# Altium schematic sheet GPIO,CONNECTOR.SchDoc: F2837x controlCARD
size 431 x 279 mm; Organization: Texas Instruments; Revision: 1.3
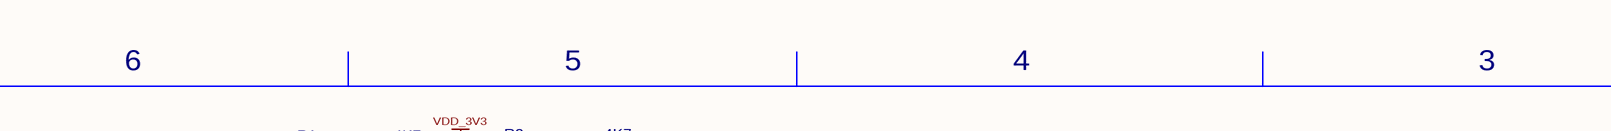
[diagram p0: GPIO,CONNECTOR.SchDoc, top left]
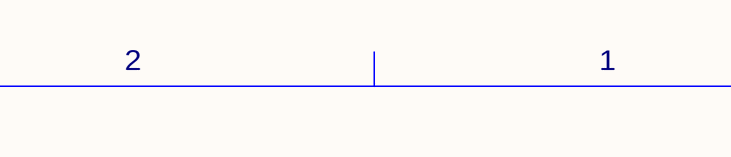
[diagram p1: GPIO,CONNECTOR.SchDoc, top right]
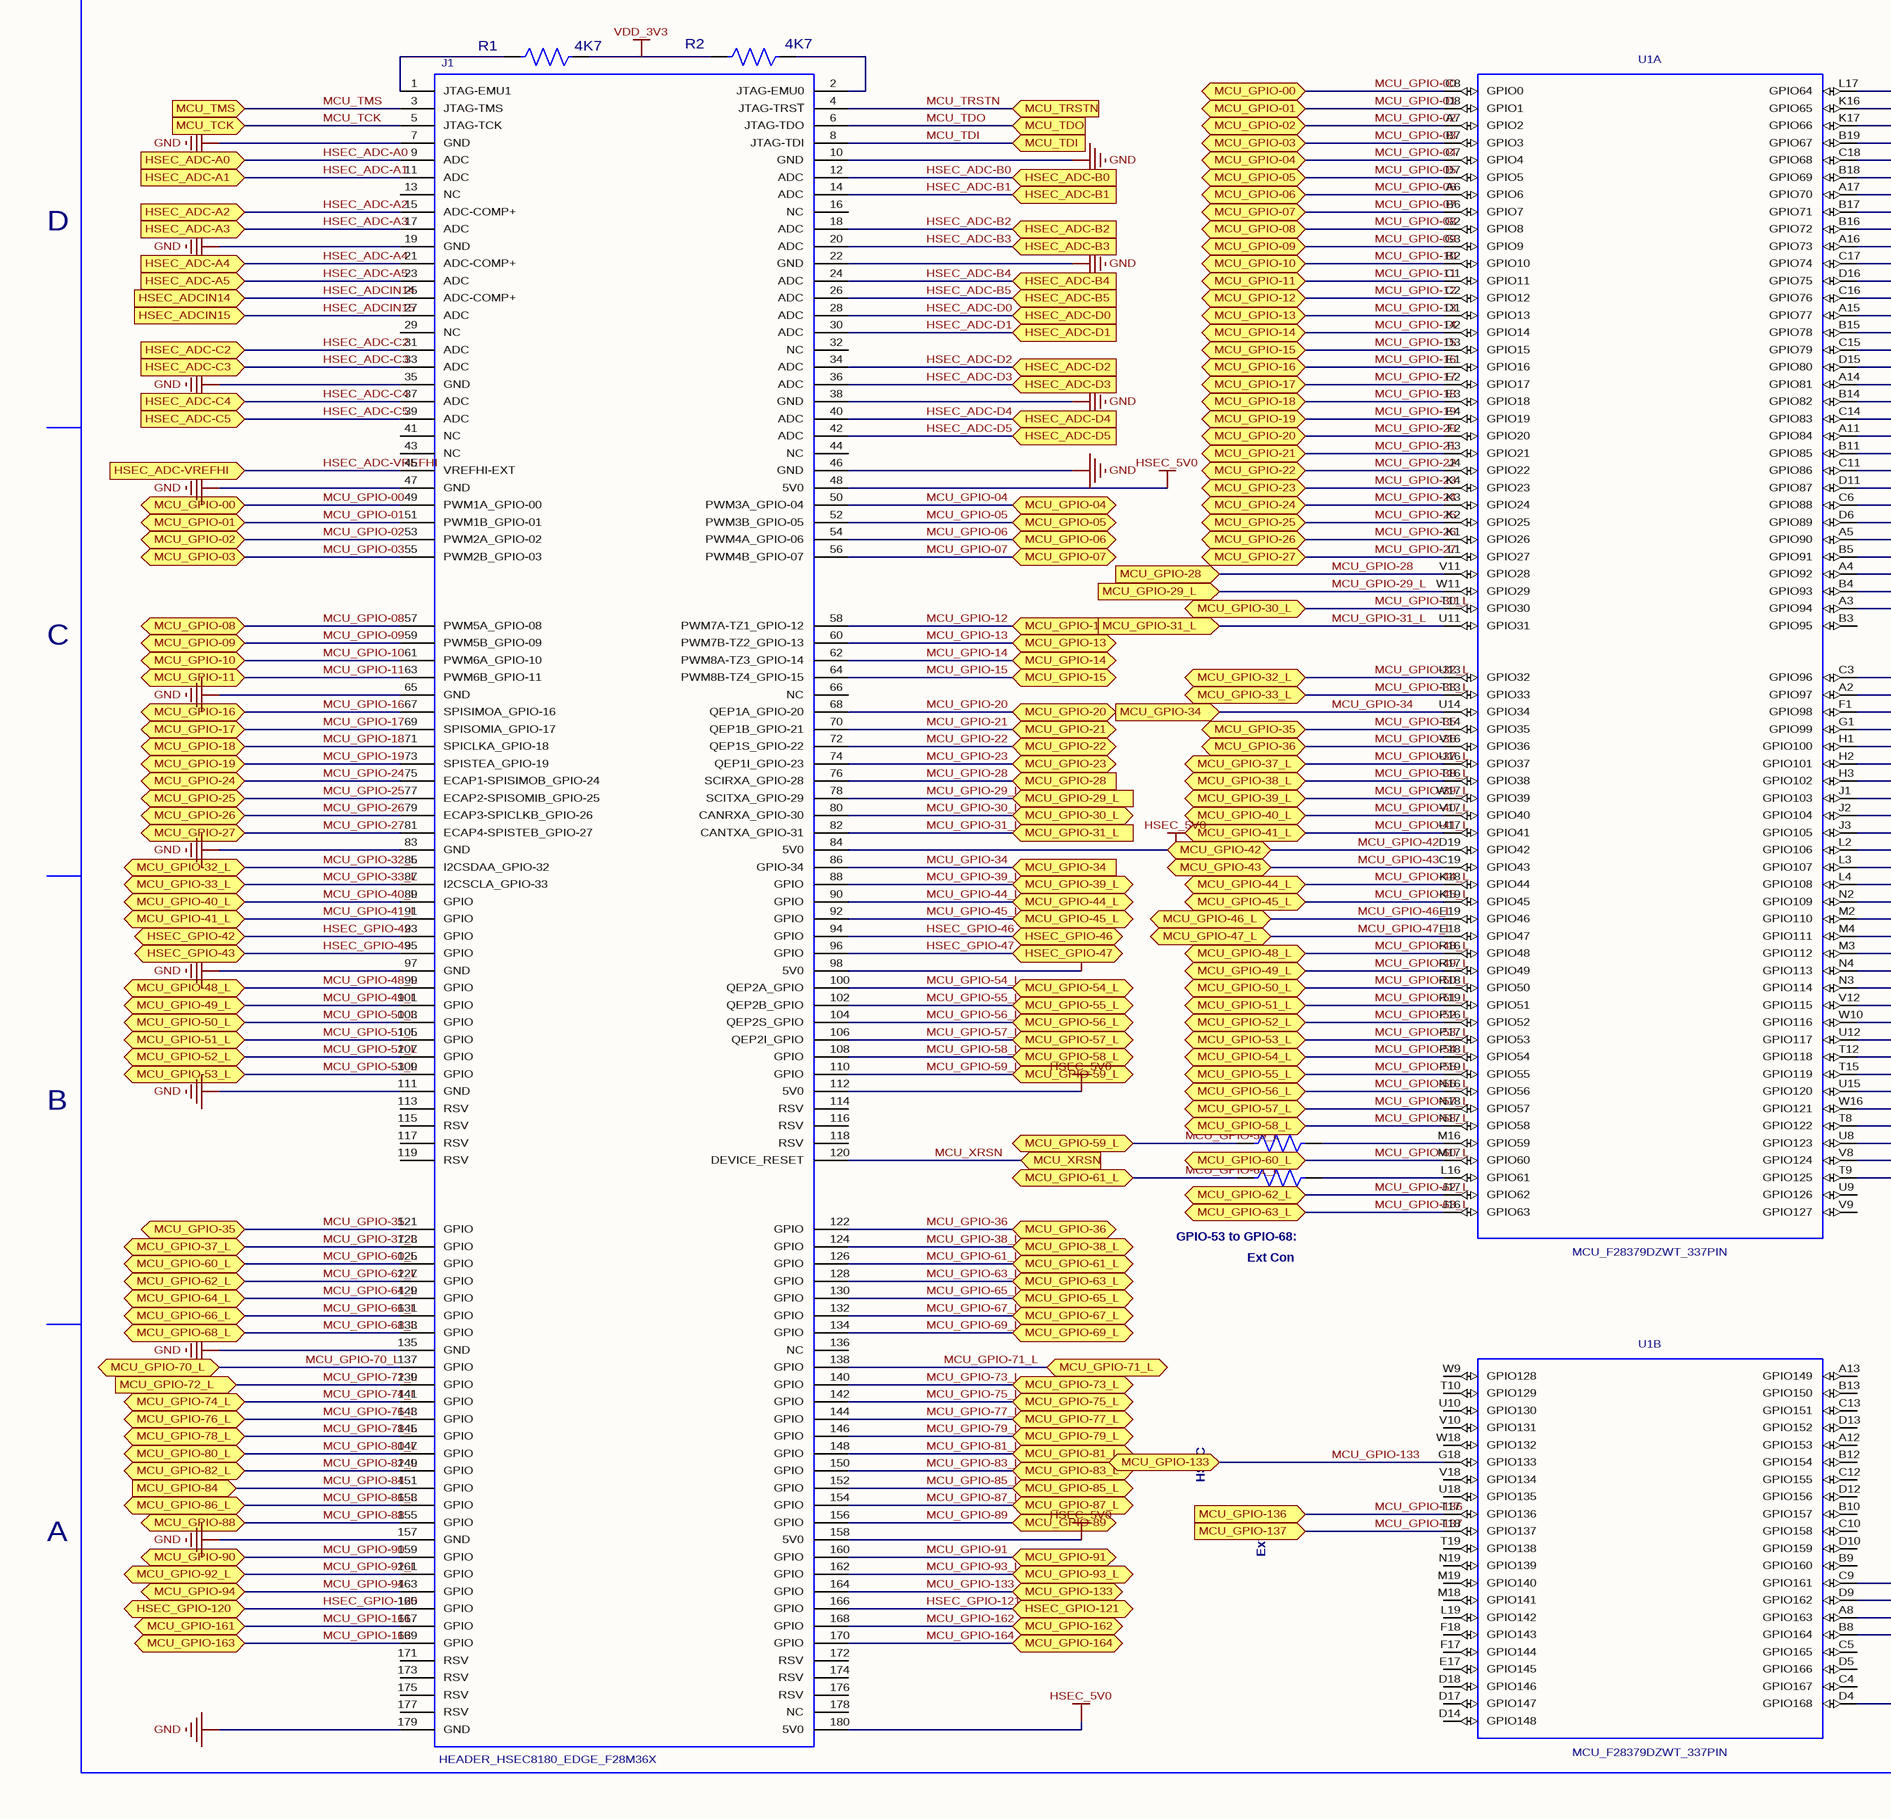
[diagram p2: GPIO,CONNECTOR.SchDoc, bottom left]
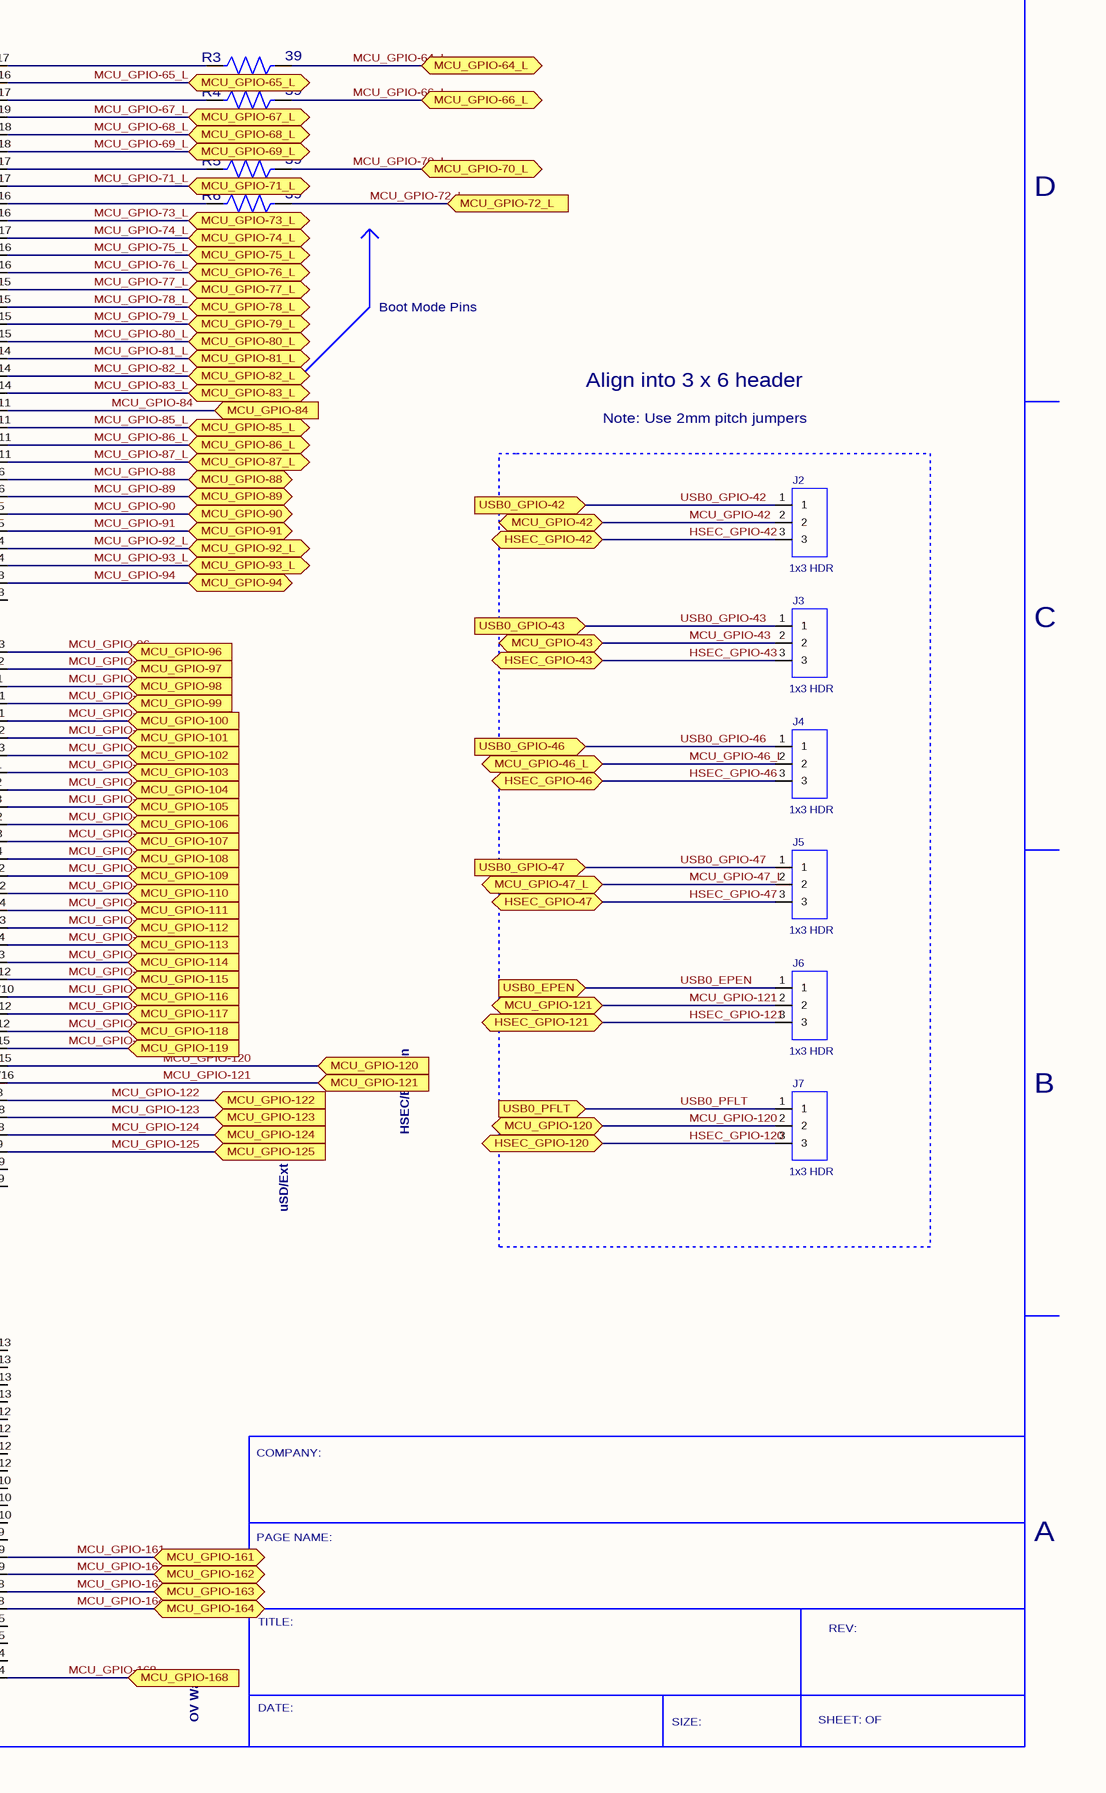
[diagram p3: GPIO,CONNECTOR.SchDoc, bottom right]

## Parts
J1  HEADER_HSEC8180_EDGE_F28M36X  [HEADER_HSEC8_180_EDGE]
J2  value 1x3 HDR  [HDR1X3_2MM]  (hidden comment: HEADER_1X3_079)
J3  value 1x3 HDR  [HDR1X3_2MM]  (hidden comment: HEADER_1X3_079)
J4  value 1x3 HDR  [HDR1X3_2MM]  (hidden comment: HEADER_1X3_079)
J5  value 1x3 HDR  [HDR1X3_2MM]  (hidden comment: HEADER_1X3_079)
J6  value 1x3 HDR  [HDR1X3_2MM]  (hidden comment: HEADER_1X3_079)
J7  value 1x3 HDR  [HDR1X3_2MM]  (hidden comment: HEADER_1X3_079)
R1  value 4K7  [R0402]  (hidden comment: R0402_1%)
R2  value 4K7  [R0402]  (hidden comment: R0402_1%)
R3  value 39  [R0402]  (hidden comment: R0402_5%)
R4  value 39  [R0402]  (hidden comment: R0402_5%)
R5  value 39  [R0402]  (hidden comment: R0402_5%)
R6  value 39  [R0402]  (hidden comment: R0402_5%)
R7  value 39  [R0402]  (hidden comment: R0402_5%)
R8  value 39  [R0402]  (hidden comment: R0402_5%)
U1  MCU_F28379DZWT_337PIN  [TI_ZWT_337BGA]  (parts A,B of 5)

## Ports
HSEC_ADC-A0, HSEC_ADC-A1, HSEC_ADC-A2, HSEC_ADC-A3, HSEC_ADC-A4, HSEC_ADC-A5, HSEC_ADC-B0, HSEC_ADC-B1, HSEC_ADC-B2, HSEC_ADC-B3, HSEC_ADC-B4, HSEC_ADC-B5, HSEC_ADC-C2, HSEC_ADC-C3, HSEC_ADC-C4, HSEC_ADC-C5, HSEC_ADC-D0, HSEC_ADC-D1, HSEC_ADC-D2, HSEC_ADC-D3, HSEC_ADC-D4, HSEC_ADC-D5, HSEC_ADC-VREFHI, HSEC_ADCIN14, HSEC_ADCIN15, HSEC_GPIO-42 (bidir), HSEC_GPIO-43 (bidir), HSEC_GPIO-46 (bidir), HSEC_GPIO-47 (bidir), HSEC_GPIO-120 (bidir), HSEC_GPIO-121 (bidir), MCU_GPIO-00 (bidir), MCU_GPIO-01 (bidir), MCU_GPIO-02 (bidir), MCU_GPIO-03 (bidir), MCU_GPIO-04 (bidir), MCU_GPIO-05 (bidir), MCU_GPIO-06 (bidir), MCU_GPIO-07 (bidir), MCU_GPIO-08 (bidir), MCU_GPIO-09 (bidir), MCU_GPIO-10 (bidir), MCU_GPIO-11 (bidir), MCU_GPIO-12 (bidir), MCU_GPIO-13 (bidir), MCU_GPIO-14 (bidir), MCU_GPIO-15 (bidir), MCU_GPIO-16 (bidir), MCU_GPIO-17 (bidir), MCU_GPIO-18 (bidir), MCU_GPIO-19 (bidir), MCU_GPIO-20 (bidir), MCU_GPIO-21 (bidir), MCU_GPIO-22 (bidir), MCU_GPIO-23 (bidir), MCU_GPIO-24 (bidir), MCU_GPIO-25 (bidir), MCU_GPIO-26 (bidir), MCU_GPIO-27 (bidir), MCU_GPIO-28, MCU_GPIO-29_L, MCU_GPIO-30_L (bidir), MCU_GPIO-31_L, MCU_GPIO-32_L (bidir), MCU_GPIO-33_L (bidir), MCU_GPIO-34, MCU_GPIO-35 (bidir), MCU_GPIO-36 (bidir), MCU_GPIO-37_L (bidir), MCU_GPIO-38_L (bidir), MCU_GPIO-39_L (bidir), MCU_GPIO-40_L (bidir), MCU_GPIO-41_L (bidir), MCU_GPIO-42 (bidir), MCU_GPIO-43 (bidir), MCU_GPIO-44_L (bidir), MCU_GPIO-45_L (bidir), MCU_GPIO-46_L (bidir), MCU_GPIO-47_L (bidir), MCU_GPIO-48_L (bidir), MCU_GPIO-49_L (bidir), MCU_GPIO-50_L (bidir), MCU_GPIO-51_L (bidir), MCU_GPIO-52_L (bidir), MCU_GPIO-53_L (bidir), MCU_GPIO-54_L (bidir), MCU_GPIO-55_L (bidir), MCU_GPIO-56_L (bidir), MCU_GPIO-57_L (bidir), MCU_GPIO-58_L (bidir), MCU_GPIO-59_L (bidir), MCU_GPIO-60_L (bidir), MCU_GPIO-61_L (bidir), MCU_GPIO-62_L (bidir), MCU_GPIO-63_L (bidir), MCU_GPIO-64_L (bidir), MCU_GPIO-65_L (bidir), MCU_GPIO-66_L (bidir), MCU_GPIO-67_L (bidir), MCU_GPIO-68_L (bidir), MCU_GPIO-69_L (bidir), MCU_GPIO-70_L (bidir), MCU_GPIO-71_L (bidir), MCU_GPIO-72_L, MCU_GPIO-73_L (bidir), MCU_GPIO-74_L (bidir), MCU_GPIO-75_L (bidir), MCU_GPIO-76_L (bidir), MCU_GPIO-77_L (bidir), MCU_GPIO-78_L (bidir), MCU_GPIO-79_L (bidir), MCU_GPIO-80_L (bidir), MCU_GPIO-81_L (bidir), MCU_GPIO-82_L (bidir), MCU_GPIO-83_L (bidir), MCU_GPIO-84, MCU_GPIO-85_L (bidir), MCU_GPIO-86_L (bidir), MCU_GPIO-87_L (bidir), MCU_GPIO-88 (bidir), MCU_GPIO-89 (bidir), MCU_GPIO-90 (bidir), MCU_GPIO-91 (bidir), MCU_GPIO-92_L (bidir), MCU_GPIO-93_L (bidir), MCU_GPIO-94 (bidir), MCU_GPIO-96, MCU_GPIO-97, MCU_GPIO-98, MCU_GPIO-99, MCU_GPIO-100, MCU_GPIO-101, MCU_GPIO-102, MCU_GPIO-103, MCU_GPIO-104, MCU_GPIO-105, MCU_GPIO-106, MCU_GPIO-107, MCU_GPIO-108, MCU_GPIO-109, MCU_GPIO-110, MCU_GPIO-111, MCU_GPIO-112, MCU_GPIO-113, MCU_GPIO-114, MCU_GPIO-115, MCU_GPIO-116, MCU_GPIO-117, MCU_GPIO-118, MCU_GPIO-119, MCU_GPIO-120, MCU_GPIO-120 (bidir), MCU_GPIO-121, MCU_GPIO-121 (bidir), MCU_GPIO-122, MCU_GPIO-123, MCU_GPIO-124, MCU_GPIO-125, MCU_GPIO-133 (bidir), MCU_GPIO-136, MCU_GPIO-137, MCU_GPIO-161 (bidir), MCU_GPIO-162 (bidir), MCU_GPIO-163 (bidir), MCU_GPIO-164 (bidir), MCU_GPIO-168, MCU_TCK, MCU_TDI, MCU_TDO, MCU_TMS, MCU_TRSTN, MCU_XRSN, USB0_EPEN, USB0_GPIO-42, USB0_GPIO-43, USB0_GPIO-46, USB0_GPIO-47, USB0_PFLT

## Nets
GND: J1.7(GND) J1.10(GND) J1.19(GND) J1.22(GND) J1.35(GND) J1.38(GND) J1.46(GND) J1.47(GND) J1.65(GND) J1.83(GND) J1.97(GND) J1.111(GND) J1.135(GND) J1.157(GND) J1.179(GND)
MCU_GPIO-42: J1.48(5V0) J1.84(5V0) J1.98(5V0) J1.112(5V0) J1.158(5V0) J1.180(5V0) J2.2 U1.D19(GPIO42) ; port MCU_GPIO-42  [also labelled HSEC_5V0]
VDD_3V3: R1.1 R2.2
HSEC_ADC-A0: J1.9(ADC) ; port HSEC_ADC-A0
HSEC_ADC-A1: J1.11(ADC) ; port HSEC_ADC-A1
HSEC_ADC-A2: J1.15(ADC-COMP+) ; port HSEC_ADC-A2
HSEC_ADC-A3: J1.17(ADC) ; port HSEC_ADC-A3
HSEC_ADC-A4: J1.21(ADC-COMP+) ; port HSEC_ADC-A4
HSEC_ADC-A5: J1.23(ADC) ; port HSEC_ADC-A5
HSEC_ADC-B0: J1.12(ADC) ; port HSEC_ADC-B0
HSEC_ADC-B1: J1.14(ADC) ; port HSEC_ADC-B1
HSEC_ADC-B2: J1.18(ADC) ; port HSEC_ADC-B2
HSEC_ADC-B3: J1.20(ADC) ; port HSEC_ADC-B3
HSEC_ADC-B4: J1.24(ADC) ; port HSEC_ADC-B4
HSEC_ADC-B5: J1.26(ADC) ; port HSEC_ADC-B5
HSEC_ADC-C2: J1.31(ADC) ; port HSEC_ADC-C2
HSEC_ADC-C3: J1.33(ADC) ; port HSEC_ADC-C3
HSEC_ADC-C4: J1.37(ADC) ; port HSEC_ADC-C4
HSEC_ADC-C5: J1.39(ADC) ; port HSEC_ADC-C5
HSEC_ADC-D0: J1.28(ADC) ; port HSEC_ADC-D0
HSEC_ADC-D1: J1.30(ADC) ; port HSEC_ADC-D1
HSEC_ADC-D2: J1.34(ADC) ; port HSEC_ADC-D2
HSEC_ADC-D3: J1.36(ADC) ; port HSEC_ADC-D3
HSEC_ADC-D4: J1.40(ADC) ; port HSEC_ADC-D4
HSEC_ADC-D5: J1.42(ADC) ; port HSEC_ADC-D5
HSEC_ADC-VREFHI: J1.45(VREFHI-EXT) ; port HSEC_ADC-VREFHI
HSEC_ADCIN14: J1.25(ADC-COMP+) ; port HSEC_ADCIN14
HSEC_ADCIN15: J1.27(ADC) ; port HSEC_ADCIN15
HSEC_GPIO-42: J1.93(GPIO) J2.3 ; port HSEC_GPIO-42
HSEC_GPIO-43: J1.95(GPIO) J3.3 ; port HSEC_GPIO-43
HSEC_GPIO-46: J1.94(GPIO) J4.3 ; port HSEC_GPIO-46
HSEC_GPIO-47: J1.96(GPIO) J5.3 ; port HSEC_GPIO-47
HSEC_GPIO-120: J1.165(GPIO) J7.3 ; port HSEC_GPIO-120
HSEC_GPIO-121: J1.166(GPIO) J6.3 ; port HSEC_GPIO-121
MCU_GPIO-00: J1.49(PWM1A_GPIO-00) U1.C8(GPIO0) ; port MCU_GPIO-00
MCU_GPIO-01: J1.51(PWM1B_GPIO-01) U1.D8(GPIO1) ; port MCU_GPIO-01
MCU_GPIO-02: J1.53(PWM2A_GPIO-02) U1.A7(GPIO2) ; port MCU_GPIO-02
MCU_GPIO-03: J1.55(PWM2B_GPIO-03) U1.B7(GPIO3) ; port MCU_GPIO-03
MCU_GPIO-04: J1.50(PWM3A_GPIO-04) U1.C7(GPIO4) ; port MCU_GPIO-04
MCU_GPIO-05: J1.52(PWM3B_GPIO-05) U1.D7(GPIO5) ; port MCU_GPIO-05
MCU_GPIO-06: J1.54(PWM4A_GPIO-06) U1.A6(GPIO6) ; port MCU_GPIO-06
MCU_GPIO-07: J1.56(PWM4B_GPIO-07) U1.B6(GPIO7) ; port MCU_GPIO-07
MCU_GPIO-08: J1.57(PWM5A_GPIO-08) U1.G2(GPIO8) ; port MCU_GPIO-08
MCU_GPIO-09: J1.59(PWM5B_GPIO-09) U1.G3(GPIO9) ; port MCU_GPIO-09
MCU_GPIO-10: J1.61(PWM6A_GPIO-10) U1.B2(GPIO10) ; port MCU_GPIO-10
MCU_GPIO-11: J1.63(PWM6B_GPIO-11) U1.C1(GPIO11) ; port MCU_GPIO-11
MCU_GPIO-12: J1.58(PWM7A-TZ1_GPIO-12) U1.C2(GPIO12) ; port MCU_GPIO-12
MCU_GPIO-13: J1.60(PWM7B-TZ2_GPIO-13) U1.D1(GPIO13) ; port MCU_GPIO-13
MCU_GPIO-14: J1.62(PWM8A-TZ3_GPIO-14) U1.D2(GPIO14) ; port MCU_GPIO-14
MCU_GPIO-15: J1.64(PWM8B-TZ4_GPIO-15) U1.D3(GPIO15) ; port MCU_GPIO-15
MCU_GPIO-16: J1.67(SPISIMOA_GPIO-16) U1.E1(GPIO16) ; port MCU_GPIO-16
MCU_GPIO-17: J1.69(SPISOMIA_GPIO-17) U1.E2(GPIO17) ; port MCU_GPIO-17
MCU_GPIO-18: J1.71(SPICLKA_GPIO-18) U1.E3(GPIO18) ; port MCU_GPIO-18
MCU_GPIO-19: J1.73(SPISTEA_GPIO-19) U1.E4(GPIO19) ; port MCU_GPIO-19
MCU_GPIO-20: J1.68(QEP1A_GPIO-20) J1.86(GPIO-34) U1.F2(GPIO20) U1.U14(GPIO34) ; port MCU_GPIO-20, port MCU_GPIO-34  [also labelled MCU_GPIO-34]
MCU_GPIO-21: J1.70(QEP1B_GPIO-21) U1.F3(GPIO21) ; port MCU_GPIO-21
MCU_GPIO-22: J1.72(QEP1S_GPIO-22) U1.J4(GPIO22) ; port MCU_GPIO-22
MCU_GPIO-23: J1.74(QEP1I_GPIO-23) U1.K4(GPIO23) ; port MCU_GPIO-23
MCU_GPIO-24: J1.75(ECAP1-SPISIMOB_GPIO-24) U1.K3(GPIO24) ; port MCU_GPIO-24
MCU_GPIO-25: J1.77(ECAP2-SPISOMIB_GPIO-25) U1.K2(GPIO25) ; port MCU_GPIO-25
MCU_GPIO-26: J1.79(ECAP3-SPICLKB_GPIO-26) U1.K1(GPIO26) ; port MCU_GPIO-26
MCU_GPIO-27: J1.81(ECAP4-SPISTEB_GPIO-27) U1.L1(GPIO27) ; port MCU_GPIO-27
MCU_GPIO-28: J1.76(SCIRXA_GPIO-28) U1.V11(GPIO28) ; port MCU_GPIO-28
MCU_GPIO-29_L: J1.78(SCITXA_GPIO-29) U1.W11(GPIO29) ; port MCU_GPIO-29_L
MCU_GPIO-30_L: J1.80(CANRXA_GPIO-30) U1.T11(GPIO30) ; port MCU_GPIO-30_L
MCU_GPIO-31_L: J1.82(CANTXA_GPIO-31) U1.U11(GPIO31) ; port MCU_GPIO-31_L
MCU_GPIO-32_L: J1.85(I2CSDAA_GPIO-32) U1.U13(GPIO32) ; port MCU_GPIO-32_L
MCU_GPIO-33_L: J1.87(I2CSCLA_GPIO-33) U1.T13(GPIO33) ; port MCU_GPIO-33_L
MCU_GPIO-35: J1.121(GPIO) U1.T14(GPIO35) ; port MCU_GPIO-35
MCU_GPIO-36: J1.122(GPIO) U1.V16(GPIO36) ; port MCU_GPIO-36
MCU_GPIO-37_L: J1.123(GPIO) U1.U16(GPIO37) ; port MCU_GPIO-37_L
MCU_GPIO-38_L: J1.124(GPIO) U1.T16(GPIO38) ; port MCU_GPIO-38_L
MCU_GPIO-39_L: J1.88(GPIO) U1.W17(GPIO39) ; port MCU_GPIO-39_L
MCU_GPIO-40_L: J1.89(GPIO) U1.V17(GPIO40) ; port MCU_GPIO-40_L
MCU_GPIO-41_L: J1.91(GPIO) U1.U17(GPIO41) ; port MCU_GPIO-41_L
MCU_GPIO-43: J3.2 U1.C19(GPIO43) ; port MCU_GPIO-43
MCU_GPIO-44_L: J1.90(GPIO) U1.K18(GPIO44) ; port MCU_GPIO-44_L
MCU_GPIO-45_L: J1.92(GPIO) U1.K19(GPIO45) ; port MCU_GPIO-45_L
MCU_GPIO-46_L: J4.2 U1.E19(GPIO46) ; port MCU_GPIO-46_L
MCU_GPIO-47_L: J5.2 U1.E18(GPIO47) ; port MCU_GPIO-47_L
MCU_GPIO-48_L: J1.99(GPIO) U1.R16(GPIO48) ; port MCU_GPIO-48_L
MCU_GPIO-49_L: J1.101(GPIO) U1.R17(GPIO49) ; port MCU_GPIO-49_L
MCU_GPIO-50_L: J1.103(GPIO) U1.R18(GPIO50) ; port MCU_GPIO-50_L
MCU_GPIO-51_L: J1.105(GPIO) U1.R19(GPIO51) ; port MCU_GPIO-51_L
MCU_GPIO-52_L: J1.107(GPIO) U1.P16(GPIO52) ; port MCU_GPIO-52_L
MCU_GPIO-53_L: J1.109(GPIO) U1.P17(GPIO53) ; port MCU_GPIO-53_L
MCU_GPIO-54_L: J1.100(QEP2A_GPIO) U1.P18(GPIO54) ; port MCU_GPIO-54_L
MCU_GPIO-55_L: J1.102(QEP2B_GPIO) U1.P19(GPIO55) ; port MCU_GPIO-55_L
MCU_GPIO-56_L: J1.104(QEP2S_GPIO) U1.N16(GPIO56) ; port MCU_GPIO-56_L
MCU_GPIO-57_L: J1.106(QEP2I_GPIO) U1.N18(GPIO57) ; port MCU_GPIO-57_L
MCU_GPIO-58_L: J1.108(GPIO) U1.N17(GPIO58) ; port MCU_GPIO-58_L
MCU_GPIO-59_L: J1.110(GPIO) R7.1 ; port MCU_GPIO-59_L
MCU_GPIO-60_L: J1.125(GPIO) U1.M17(GPIO60) ; port MCU_GPIO-60_L
MCU_GPIO-61_L: J1.126(GPIO) R8.1 ; port MCU_GPIO-61_L
MCU_GPIO-62_L: J1.127(GPIO) U1.J17(GPIO62) ; port MCU_GPIO-62_L
MCU_GPIO-63_L: J1.128(GPIO) U1.J16(GPIO63) ; port MCU_GPIO-63_L
MCU_GPIO-64_L: J1.129(GPIO) R3.2 ; port MCU_GPIO-64_L
MCU_GPIO-65_L: J1.130(GPIO) U1.K16(GPIO65) ; port MCU_GPIO-65_L
MCU_GPIO-66_L: J1.131(GPIO) R4.2 ; port MCU_GPIO-66_L
MCU_GPIO-67_L: J1.132(GPIO) U1.B19(GPIO67) ; port MCU_GPIO-67_L
MCU_GPIO-68_L: J1.133(GPIO) U1.C18(GPIO68) ; port MCU_GPIO-68_L
MCU_GPIO-69_L: J1.134(GPIO) U1.B18(GPIO69) ; port MCU_GPIO-69_L
MCU_GPIO-70_L: J1.137(GPIO) R5.2 ; port MCU_GPIO-70_L
MCU_GPIO-71_L: J1.138(GPIO) U1.B17(GPIO71) ; port MCU_GPIO-71_L
MCU_GPIO-72_L: J1.139(GPIO) R6.2 ; port MCU_GPIO-72_L
MCU_GPIO-73_L: J1.140(GPIO) U1.A16(GPIO73) ; port MCU_GPIO-73_L
MCU_GPIO-74_L: J1.141(GPIO) U1.C17(GPIO74) ; port MCU_GPIO-74_L
MCU_GPIO-75_L: J1.142(GPIO) U1.D16(GPIO75) ; port MCU_GPIO-75_L
MCU_GPIO-76_L: J1.143(GPIO) U1.C16(GPIO76) ; port MCU_GPIO-76_L
MCU_GPIO-77_L: J1.144(GPIO) U1.A15(GPIO77) ; port MCU_GPIO-77_L
MCU_GPIO-78_L: J1.145(GPIO) U1.B15(GPIO78) ; port MCU_GPIO-78_L
MCU_GPIO-79_L: J1.146(GPIO) U1.C15(GPIO79) ; port MCU_GPIO-79_L
MCU_GPIO-80_L: J1.147(GPIO) U1.D15(GPIO80) ; port MCU_GPIO-80_L
MCU_GPIO-81_L: J1.148(GPIO) U1.A14(GPIO81) ; port MCU_GPIO-81_L
MCU_GPIO-82_L: J1.149(GPIO) U1.B14(GPIO82) ; port MCU_GPIO-82_L
MCU_GPIO-83_L: J1.150(GPIO) U1.C14(GPIO83) ; port MCU_GPIO-83_L
MCU_GPIO-84: J1.151(GPIO) U1.A11(GPIO84) ; port MCU_GPIO-84
MCU_GPIO-85_L: J1.152(GPIO) U1.B11(GPIO85) ; port MCU_GPIO-85_L
MCU_GPIO-86_L: J1.153(GPIO) U1.C11(GPIO86) ; port MCU_GPIO-86_L
MCU_GPIO-87_L: J1.154(GPIO) U1.D11(GPIO87) ; port MCU_GPIO-87_L
MCU_GPIO-88: J1.155(GPIO) U1.C6(GPIO88) ; port MCU_GPIO-88
MCU_GPIO-89: J1.156(GPIO) U1.D6(GPIO89) ; port MCU_GPIO-89
MCU_GPIO-90: J1.159(GPIO) U1.A5(GPIO90) ; port MCU_GPIO-90
MCU_GPIO-91: J1.160(GPIO) U1.B5(GPIO91) ; port MCU_GPIO-91
MCU_GPIO-92_L: J1.161(GPIO) U1.A4(GPIO92) ; port MCU_GPIO-92_L
MCU_GPIO-93_L: J1.162(GPIO) U1.B4(GPIO93) ; port MCU_GPIO-93_L
MCU_GPIO-94: J1.163(GPIO) U1.A3(GPIO94) ; port MCU_GPIO-94
MCU_GPIO-96: U1.C3(GPIO96) ; port MCU_GPIO-96
MCU_GPIO-97: U1.A2(GPIO97) ; port MCU_GPIO-97
MCU_GPIO-98: U1.F1(GPIO98) ; port MCU_GPIO-98
MCU_GPIO-99: U1.G1(GPIO99) ; port MCU_GPIO-99
MCU_GPIO-100: U1.H1(GPIO100) ; port MCU_GPIO-100
MCU_GPIO-101: U1.H2(GPIO101) ; port MCU_GPIO-101
MCU_GPIO-102: U1.H3(GPIO102) ; port MCU_GPIO-102
MCU_GPIO-103: U1.J1(GPIO103) ; port MCU_GPIO-103
MCU_GPIO-104: U1.J2(GPIO104) ; port MCU_GPIO-104
MCU_GPIO-105: U1.J3(GPIO105) ; port MCU_GPIO-105
MCU_GPIO-106: U1.L2(GPIO106) ; port MCU_GPIO-106
MCU_GPIO-107: U1.L3(GPIO107) ; port MCU_GPIO-107
MCU_GPIO-108: U1.L4(GPIO108) ; port MCU_GPIO-108
MCU_GPIO-109: U1.N2(GPIO109) ; port MCU_GPIO-109
MCU_GPIO-110: U1.M2(GPIO110) ; port MCU_GPIO-110
MCU_GPIO-111: U1.M4(GPIO111) ; port MCU_GPIO-111
MCU_GPIO-112: U1.M3(GPIO112) ; port MCU_GPIO-112
MCU_GPIO-113: U1.N4(GPIO113) ; port MCU_GPIO-113
MCU_GPIO-114: U1.N3(GPIO114) ; port MCU_GPIO-114
MCU_GPIO-115: U1.V12(GPIO115) ; port MCU_GPIO-115
MCU_GPIO-116: U1.W10(GPIO116) ; port MCU_GPIO-116
MCU_GPIO-117: U1.U12(GPIO117) ; port MCU_GPIO-117
MCU_GPIO-118: U1.T12(GPIO118) ; port MCU_GPIO-118
MCU_GPIO-119: U1.T15(GPIO119) ; port MCU_GPIO-119
MCU_GPIO-120: J7.2 U1.U15(GPIO120) ; port MCU_GPIO-120
MCU_GPIO-121: J6.2 U1.W16(GPIO121) ; port MCU_GPIO-121
MCU_GPIO-122: U1.T8(GPIO122) ; port MCU_GPIO-122
MCU_GPIO-123: U1.U8(GPIO123) ; port MCU_GPIO-123
MCU_GPIO-124: U1.V8(GPIO124) ; port MCU_GPIO-124
MCU_GPIO-125: U1.T9(GPIO125) ; port MCU_GPIO-125
MCU_GPIO-133: J1.164(GPIO) U1.G18(GPIO133) ; port MCU_GPIO-133
MCU_GPIO-136: U1.T17(GPIO136) ; port MCU_GPIO-136
MCU_GPIO-137: U1.T18(GPIO137) ; port MCU_GPIO-137
MCU_GPIO-161: J1.167(GPIO) U1.C9(GPIO161) ; port MCU_GPIO-161
MCU_GPIO-162: J1.168(GPIO) U1.D9(GPIO162) ; port MCU_GPIO-162
MCU_GPIO-163: J1.169(GPIO) U1.A8(GPIO163) ; port MCU_GPIO-163
MCU_GPIO-164: J1.170(GPIO) U1.B8(GPIO164) ; port MCU_GPIO-164
MCU_GPIO-168: U1.D4(GPIO168) ; port MCU_GPIO-168
MCU_TCK: J1.5(JTAG-TCK) ; port MCU_TCK
MCU_TDI: J1.8(JTAG-TDI) ; port MCU_TDI
MCU_TDO: J1.6(JTAG-TDO) ; port MCU_TDO
MCU_TMS: J1.3(JTAG-TMS) ; port MCU_TMS
MCU_TRSTN: J1.4(JTAG-TRS~{T}) ; port MCU_TRSTN
MCU_XRSN: J1.120(DEVICE_RESET) ; port MCU_XRSN
USB0_EPEN: J6.1 ; port USB0_EPEN
USB0_GPIO-42: J2.1 ; port USB0_GPIO-42
USB0_GPIO-43: J3.1 ; port USB0_GPIO-43
USB0_GPIO-46: J4.1 ; port USB0_GPIO-46
USB0_GPIO-47: J5.1 ; port USB0_GPIO-47
USB0_PFLT: J7.1 ; port USB0_PFLT
NetJ1_1: J1.1(JTAG-EMU1) R1.2
NetJ1_2: J1.2(JTAG-EMU0) R2.1
NetR3_1: R3.1 U1.L17(GPIO64)
NetR4_1: R4.1 U1.K17(GPIO66)
NetR5_1: R5.1 U1.A17(GPIO70)
NetR6_1: R6.1 U1.B16(GPIO72)
NetR7_2: R7.2 U1.M16(GPIO59)
NetR8_2: R8.2 U1.L16(GPIO61)

Not connected (* = marked no-connect by the designer): J1 13(NC) 16(NC) 29(NC) 32(NC) 41(NC) 43(NC) 44(NC) 66(NC) 113(RSV) 114(RSV) 115(RSV) 116(RSV) 117(RSV) 118(RSV) 119(RSV) 136(NC) 171(RSV) 172(RSV) 173(RSV) 174(RSV) 175(RSV) 176(RSV) 177(RSV) 178(NC); U1 A12(GPIO153) A13(GPIO149) B3(GPIO95) B9(GPIO160) B10(GPIO157) B12(GPIO154) B13(GPIO150) C4(GPIO167) C5(GPIO165) C10(GPIO158) C12(GPIO155) C13(GPIO151) D5(GPIO166) D10(GPIO159) D12(GPIO156) D13(GPIO152) D14(GPIO148) D17(GPIO147) D18(GPIO146) E17(GPIO145) F17(GPIO144) F18(GPIO143) L19(GPIO142) M18(GPIO141) M19(GPIO140) N19(GPIO139) T10(GPIO129) T19(GPIO138) U9(GPIO126) U10(GPIO130) U18(GPIO135) V9(GPIO127) V10(GPIO131) V18(GPIO134) W9(GPIO128) W18(GPIO132)

## Notes on the sheet
- 6
- 5
- 4
- 3
- 2
- 1
- D
- Boot Mode Pins
- Align into 3 x 6 header
- Note: Use 2mm pitch jumpers
- C
- Ext Con
- B
- HSEC/Ext Con
- (near R8) GPIO-53 to GPIO-68:
- uSD/Ext Con
- HSEC
- COMPANY:
- A
- PAGE NAME:
- TITLE:
- REV:
- OV Warn
- DATE:
- SIZE:
- SHEET: OF

## Library data of the parts
J1 = HEADER_HSEC8180_EDGE_F28M36X: 180 pin (120 + 60) HSEC8 fingers; mates with samtec connectors; Value: HEADER_HSEC8-180_EDGE; Decal: HEADER_HSEC8_180_EDGE; PCB DECAL: HEADER_HSEC8_180_EDGE
J2-J7 = HEADER_1X3_079: Header Male; 1x3, 2mm pitch; Manufacturer: Harwin Inc; Part Number: M22-2510305; PCB DECAL: HDR1X3_2MM; Decal: HDR1X3_2MM; Digikey: 952-1312-ND; Height: 3.5 (mm); Size: 6 L x 2 W, 2 LS (mm)
R1 R2 = R0402_1%: RES 1/16W 1% 0402 SMD; Decal: R0402; PCB DECAL: R0402
R3-R8 = R0402_5%: RES 1/16W 5% 0402 SMD; Decal: R0402; PCB DECAL: R0402
U1 = MCU_F28379DZWT_337PIN: MCU F2837x 337pin ZWT BGA; Part Number: TMS320F28379DZWT; Decal: TI_ZWT_337BGA; PCB DECAL: TI_ZWT_337BGA